# Altium schematic sheet sch.SchDoc: 555 Timer Circuit
size Letter; DrawnBy: Tony Liu
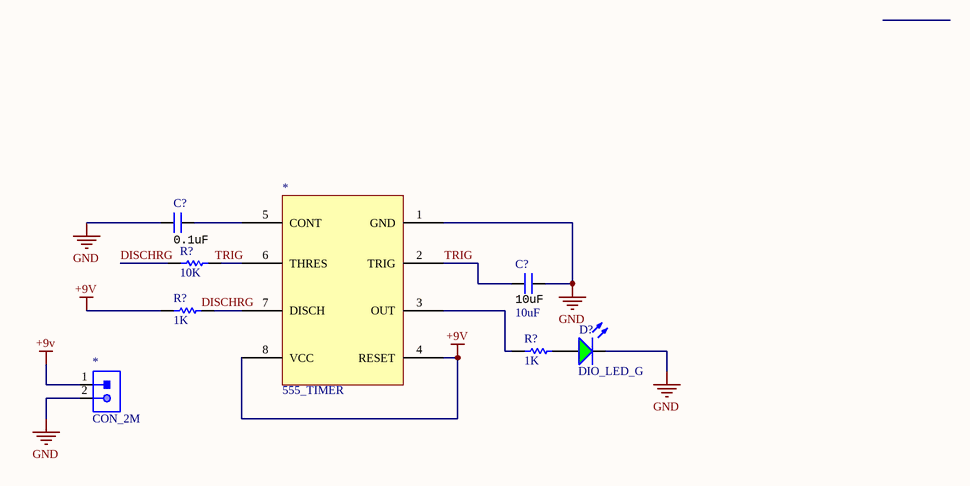
[diagram p0: sch.SchDoc]

## Parts
(Parts that share a designator on the sheet are numbered #1, #2 ... from top to bottom, then left to right.)
*#1  555_TIMER
*#2  CON_2M  [JST-B2B-PHSK]
C?#1  value 0.1uF  [CAPC0603(1608)55_N]  (hidden comment: CAP_0.1uF_16V_0603)
C?#2  10uF  [CAPC0603(1608)55_N]
D?  DIO_LED_G  [LED_0805_LINE]
R?#1  value 10K  [RESC0603(1608)_N]  (hidden comment: RES_10K_0603)
R?#2  value 1K  [RESC0603(1608)_N]  (hidden comment: RES_1K_0603)
R?#3  value 1K  [RESC0603(1608)_N]  (hidden comment: RES_1K_0603)

## Nets
+9V: *#1.4(RESET) *#1.8(VCC) *#2.1 R?#2.1
GND: *#1.1(GND) *#2.2 C?#1.1 C?#2.2 D?.2(K)
DISCHRG: R?#1.2
TRIG: *#1.2(TRIG) C?#2.1
Net*#1_3: *#1.3(OUT) R?#3.1
Net*#1_5: *#1.5(CONT) C?#1.2
Net*#1_6: *#1.6(THRES) R?#1.1
Net*#1_7: *#1.7(DISCH) R?#2.2
NetD?_1: D?.1(A) R?#3.2

## Notes on the sheet
- Labels drawn without touching a wire or pin: DISCHRG, TRIG
- Title
- Size:
- Date:
- Letter
- Drawn By:
- Sheet
- of
- File:

## Library data of the parts
C?#1 = CAP_0.1uF_16V_0603: CAP CER 0.1UF 16V X7R 0603; MPN: CC0603KRX7R7BB104; Manufacturer: Yageo; Dimensions: 0.063" L x 0.031" W (1.60mm x 0.80mm); Package: 0603 (1608 Metric); Temperature Coefficient: X7R; Voltage Rating: 16V; Digikey Part Number: 311-1088-1-ND
C?#2 = CAP_10uF_0603: CAP CER 10UF 10V X5R 0603; MPN: CC0603MRX5R6BB106; Manufacturer: Yageo; Dimensions: 0.063" L x 0.031" W (1.60mm x 0.80mm); Package: 0603 (1608 Metric); Voltage Rating: 10V; Digikey Part Number: 311-1817-1-ND; Value: 10uF
D? = DIO_LED_G: LED GREEN DIFFUSED 0805 SMD; MPN: LG R971-KN-1; Manufacturer: OSRAM; Forward Voltage Drop: 2.2V; Package: 0805 (2012 Metric); Digikey Part Number: 475-1410-1-ND
R?#1 = RES_10K_0603: RES SMD 10K OHM 5% 1/10W 0603; Manufacturer: Yageo; MPN: RC0603JR-0710KL; Package: 0603 (1608 Metric); Dimensions: 0.063" L x 0.031" W (1.60mm x 0.80mm); Tolerance: 5%; Digikey Part Number: 311-10KGRCT-ND
R?#2 R?#3 = RES_1K_0603: RES SMD 1K OHM 5% 1/10W 0603; Manufacturer: Yageo; MPN: RC0603JR-071KL; Dimensions: 0.063" L x 0.031" W (1.60mm x 0.80mm); Tolerance: 5%; Package: 0603 (1608 Metric); Digikey Part Number: 311-1.0KGRCT-ND